# Altium schematic sheet Power Generation - Buck Converter.SchDoc: [4] Power Generation - Buck Converter
size A4; ApprovedBy: Nagy Richard; CheckedBy: Nagy Richard; Author: Nagy Richard; CompanyName: EmbedCore; DrawnBy: Nagy Richard; Engineer: Nagy Richard; Organization: EmbedCore; DocumentNumber: 4; Revision: 1.0; SheetNumber: 4; SheetTotal: 15
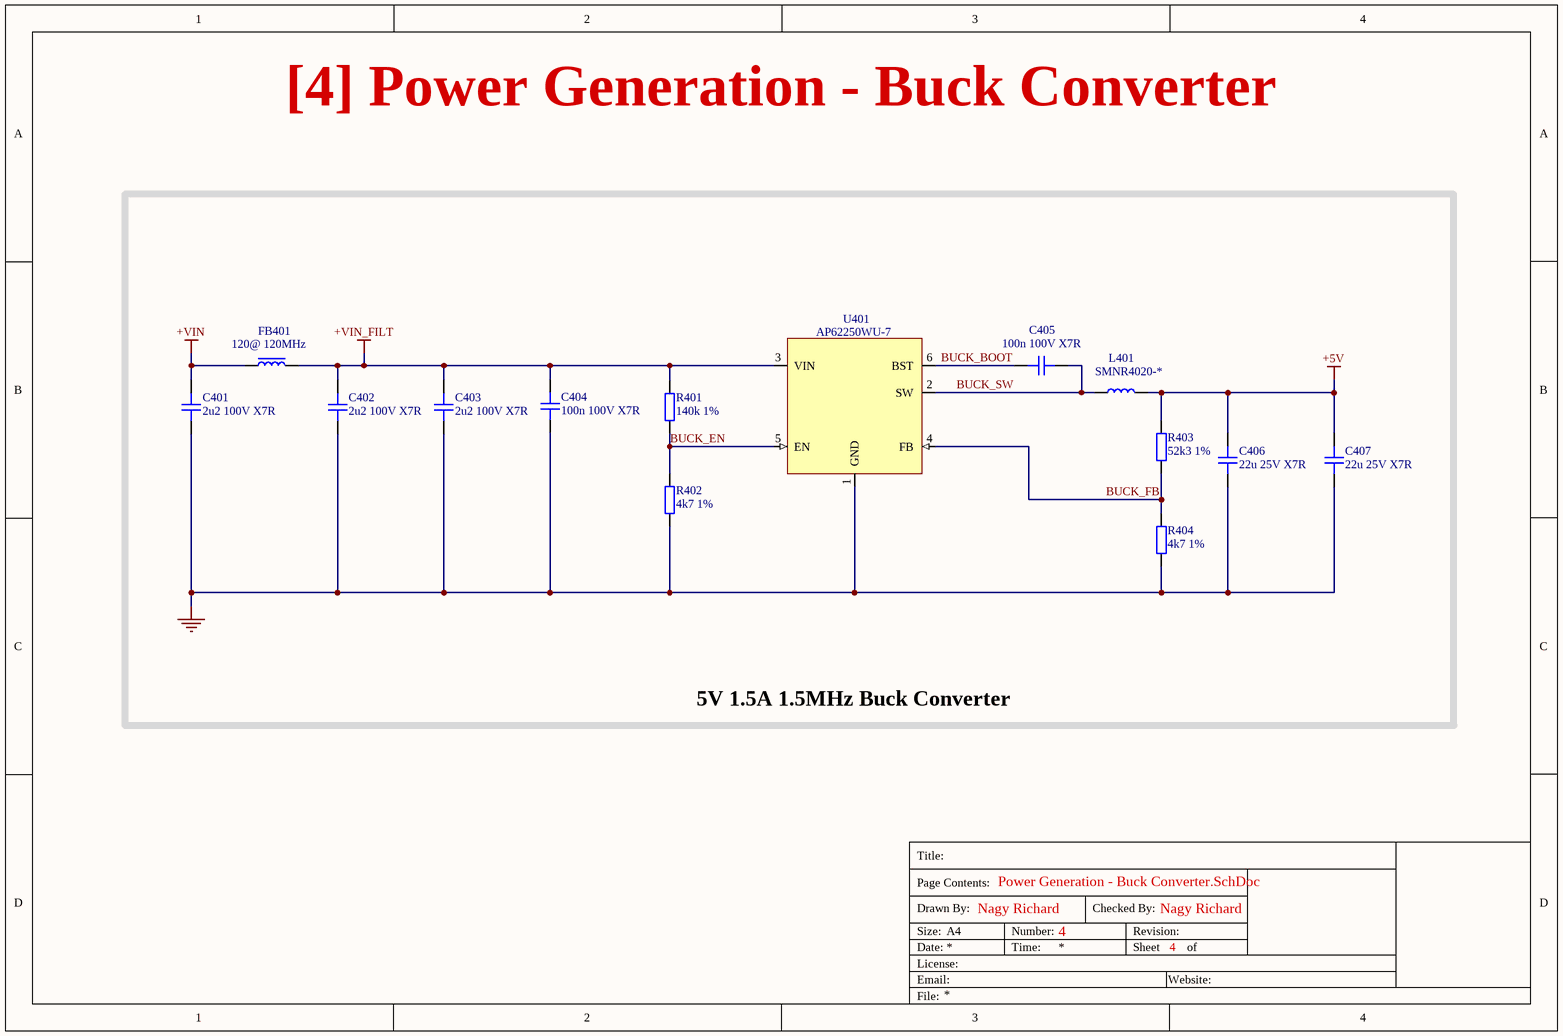
[diagram p0: Power Generation - Buck Converter.SchDoc]

## Parts
C401  2u2 100V X7R  [CAP_0805]
C402  2u2 100V X7R  [CAP_0805]
C403  2u2 100V X7R  [CAP_0805]
C404  100n 100V X7R  [CAP_0805]
C405  100n 100V X7R  [CAP_0805]
C406  22u 25V X7R  [CAP_0805]
C407  22u 25V X7R  [CAP_0805]
FB401  120@ 120MHz  [FB_0805]
L401  SMNR4020-*  [SMNR4020]
R401  140k 1%  [RES_0603]
R402  4k7 1%  [RES_0603]
R403  52k3 1%  [RES_0603]
R404  4k7 1%  [RES_0603]
U401  AP62250WU-7  [TSOT-26-6]

## Blocks framed on the sheet
5V 1.5A 1.5MHz Buck Converter: C401-C407 FB401 L401 R401-R404 U401

## Nets
+5V: C406.2 C407.2 L401.2 R403.2
+VIN: C401.2 FB401.1
+VIN_FILT: C402.2 C403.2 C404.2 FB401.2 R401.2 U401.3(VIN)
GND: C401.1 C402.1 C403.1 C404.1 C406.1 C407.1 R402.1 R404.1 U401.1(GND)
BUCK_BOOT: C405.2 U401.6(BST)
BUCK_EN: R401.1 R402.2 U401.5(EN)
BUCK_FB: R403.1 R404.2 U401.4(FB)
BUCK_SW: C405.1 L401.1 U401.2(SW)

## Notes on the sheet
- Title:
- Drawn By:
- Page Contents:
- Checked By:
- Size:
- Date:
- File:
- License:
- Email:
- A4
- Number:
- Time:
- Revision:
- Sheet
- Website:
- of

## Library data of the parts
C401-C403 C406 C407 = CAP_0805: Capacitor SMD 0805; Manufacturer: *; Manufacturer Part Number: *; Distributor Link: *; LCSC: *; Rating: *; Dielectric: *
C404 C405 = CAP_0805: Capacitor SMD 0805; Manufacturer: HUI JU; Manufacturer Part Number: NM0805B104K101CEDN; Distributor Link: www.lcsc.com; LCSC: C710457; Rating: *; Dielectric: *
FB401 = FB_0805: Ferrite Bead SMD 0805; Manufacturer: Murata Electronics; Manufacturer Part Number: BLM21AG121SN1D; Distributor Link: www.lcsc.com; LCSC: C88990
L401 = SMNR4020-*: Inductor SXN SMNR4020 Series 4x4x2mm; Manufacturer Part Number: SMNR4020-5R6MT; Manufacturer: SXN; Distributor Link: www.lcsc.com; LCSC: C467062
R401 = RES_0603: Resistor SMD 0603; Manufacturer: YAGEO; Manufacturer Part Number: RC0603FR-07140KL; Distributor Link: www.lcsc.com; LCSC: C185372
R402 R404 = RES_0603: Resistor SMD 0603; Manufacturer: UNI-ROYAL(Uniroyal Elec); Manufacturer Part Number: 0603WAF4701T5E; Distributor Link: www.lcsc.com; LCSC: C23162
R403 = RES_0603: Resistor SMD 0603; Manufacturer: UNI-ROYAL(Uniroyal Elec); Manufacturer Part Number: 0603WAF5232T5E; Distributor Link: www.lcsc.com; LCSC: C23198
U401 = AP62250WU-7: 4.2V TO 18V INPUT, 2.5A LOW IQ SYNCHRONOUS BUCK CONVERTER; Manufacturer: Diodes Incorporated; Manufacturer Part Number: AP62250WU-7; Distributor Link: https://www.mouser.de/ProductDetail/Diodes-Incorporated/AP62250WU-7?qs=7MVldsJ5Uax1PUc8sdeimQ%3D%3D